# EasyEDA schematic Lego_BLE_controller_schematic_v1.json
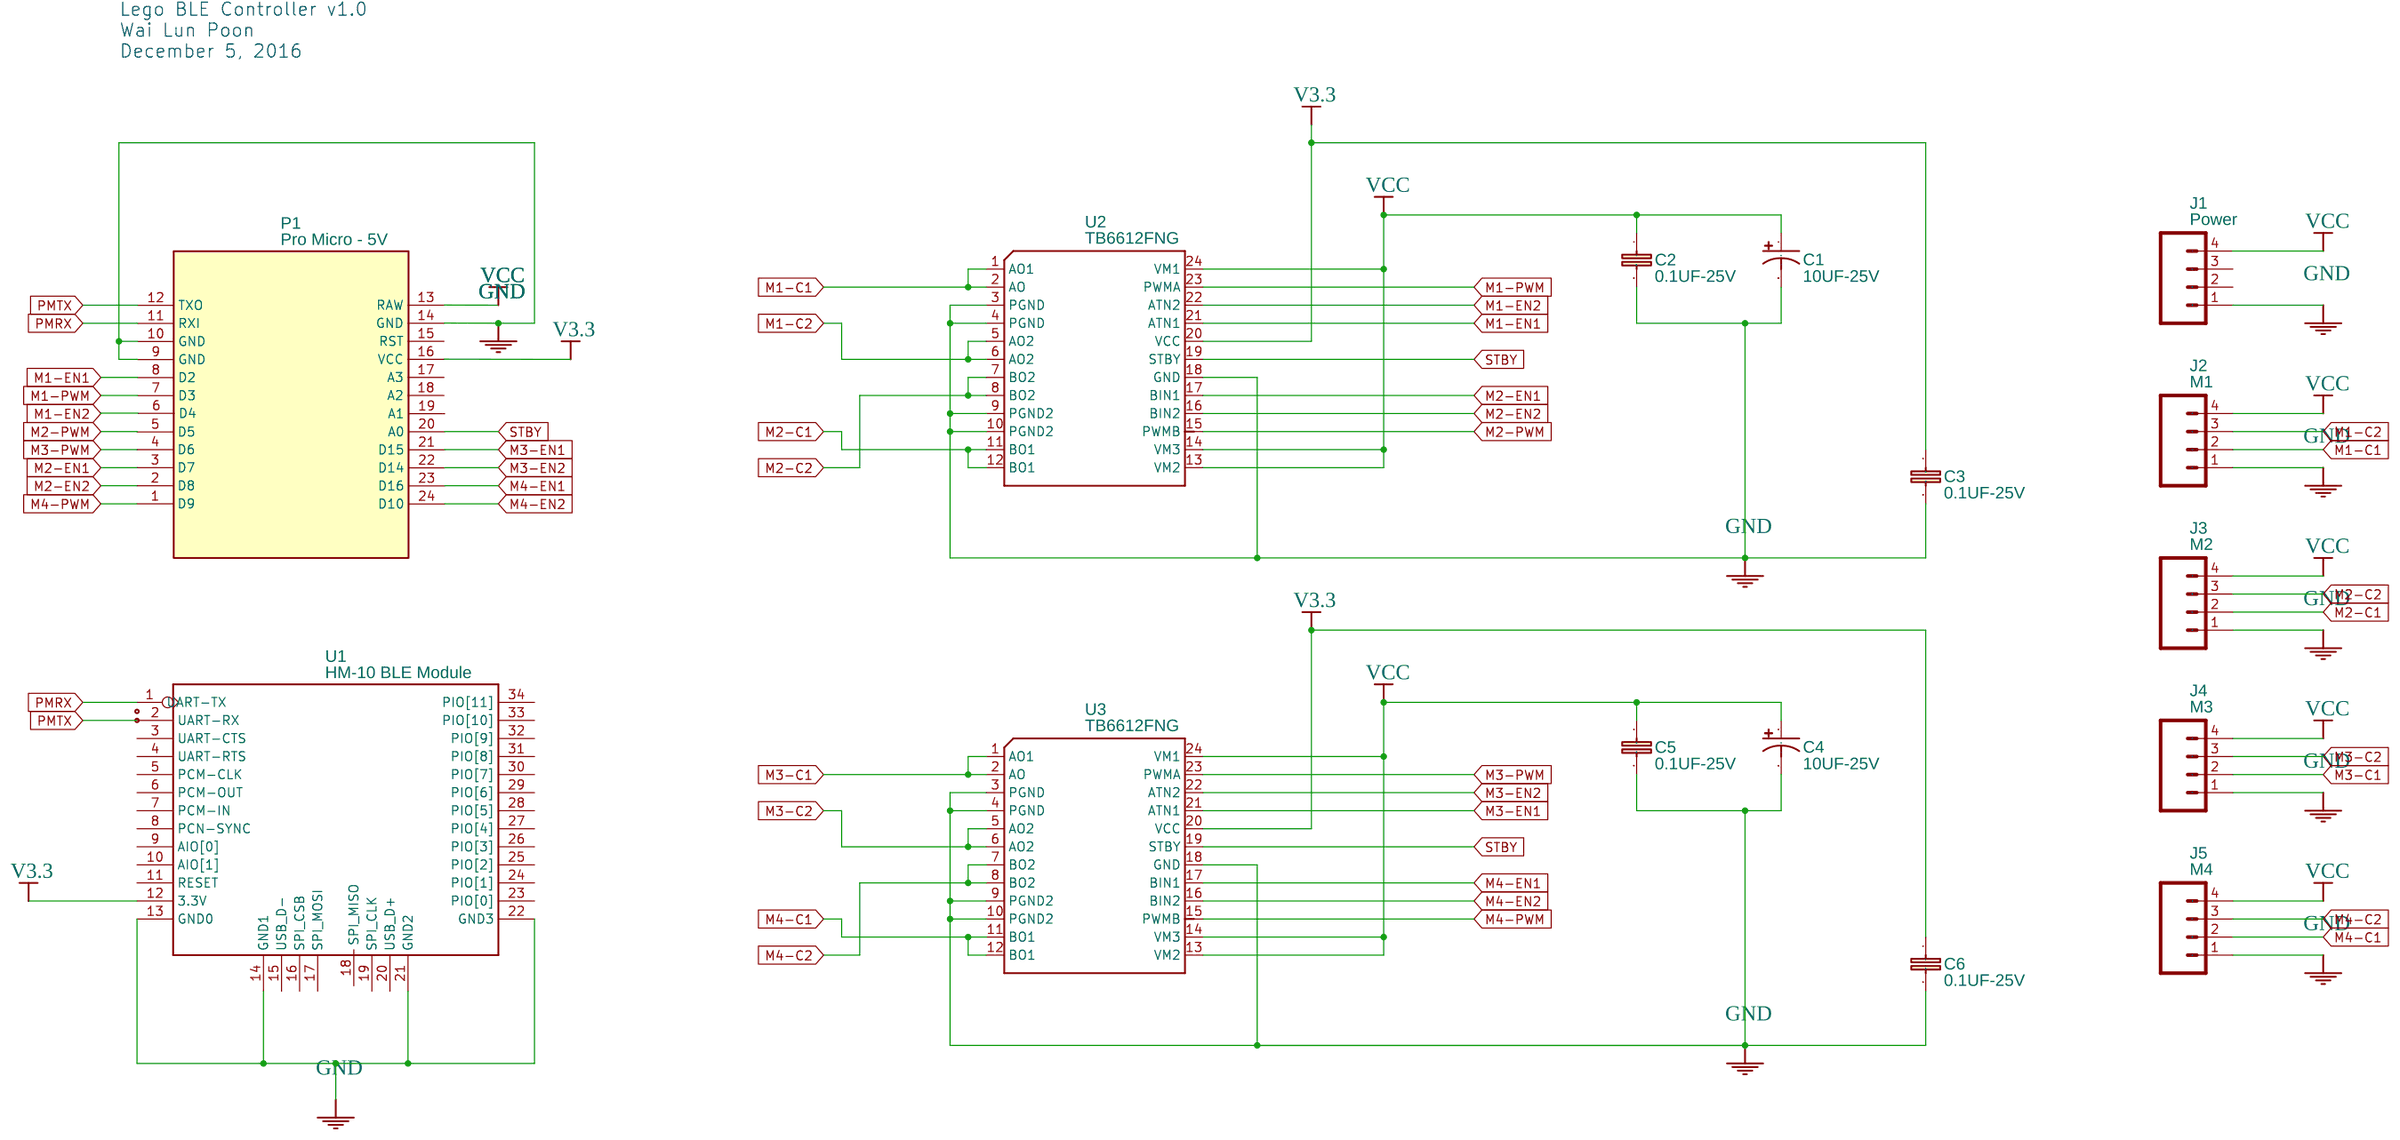
[diagram p0: schematic sheet]

## Parts
C1  10UF-25V  [EIA6032-NOM]
C2  0.1UF-25V  [0603-CAP]
C3  0.1UF-25V  [0603-CAP]
C4  10UF-25V  [EIA6032-NOM]
C5  0.1UF-25V  [0603-CAP]
C6  0.1UF-25V  [0603-CAP]
J1  Power  [JST-XH 4]
J2  M1  [JST-XH 4]
J3  M2  [JST-XH 4]
J4  M3  [JST-XH 4]
J5  M4  [JST-XH 4]
P1  Pro Micro - 5V  [Pro Micro - 5V]
U1  HM-10 BLE Module  [BT34P-SMD-1.5-26.9X13.0X2.2MM]
U2  TB6612FNG  [SSOP24-0.65-8.9X5.3MM]
U3  TB6612FNG  [SSOP24-0.65-8.9X5.3MM]

## Library data of the parts
C1 C4 = -: http:www.digikey.comproduct-detailenT491C106K025AT7280399-10159-2-ND3759638; catid: 20; Contributor: SparkFun; Manufacturer Part: ?
C2 C3 C5 C6 = -: CAP-00810; catid: 20; Contributor: SparkFun; Manufacturer Part: ?
J1-J5 = -: Header 4; catid: 20; Manufacturer Part: ?
P1 = -: catid: 20; sourceId: 1T5FDZYC8; Manufacturer Part: ?
U1 = -: SMD BT module; Bluetooth V2.0 Serial Transceiver Module - 3.3V; catid: 20; Supplier: SeeedStudio; SeeedStudio: 317030002; Manufacturer Part: HC-05; sourceId: xXR8qI0UA
U2 U3 = -: SMD IC MotorDriver;Dual -15V- 1.2A; catid: 20; sourceId: 9WQ8qkCUc; Supplier: SeeedStudio; SeeedStudio: 310040007; Manufacturer Part: TB6612FNG(O-C8-EL)

## Nets
GND: C1.C(-) C2.2 C3.2 C4.C(-) C5.2 C6.2 J1.1 J2.1 J3.1 J4.1 J5.1 P1.9(GND) P1.10(GND) P1.14(GND) U1.13(GND0) U1.14(GND1) U1.21(GND2) U1.22(GND3) U2.3(PGND) U2.4(PGND) U2.9(PGND2) U2.10(PGND2) U2.18(GND) U3.3(PGND) U3.4(PGND) U3.9(PGND2) U3.10(PGND2) U3.18(GND)
V3.3: C3.1 C6.1 P1.16(VCC) U1.12(3.3V) U2.20(VCC) U3.20(VCC)
VCC: C1.A(+) C2.1 C4.A(+) C5.1 J1.4 J2.4 J3.4 J4.4 J5.4 P1.13(RAW) U2.13(VM2) U2.14(VM3) U2.24(VM1) U3.13(VM2) U3.14(VM3) U3.24(VM1)
M1-C1: J2.2 U2.1(AO1) U2.2(AO)
M1-C2: J2.3 U2.5(AO2) U2.6(AO2)
M1-EN1: P1.8(D2) U2.21(ATN1)
M1-EN2: P1.6(D4) U2.22(ATN2)
M1-PWM: P1.7(D3) U2.23(PWMA)
M2-C1: J3.2 U2.11(BO1) U2.12(BO1)
M2-C2: J3.3 U2.7(BO2) U2.8(BO2)
M2-EN1: P1.3(D7) U2.17(BIN1)
M2-EN2: P1.2(D8) U2.16(BIN2)
M2-PWM: P1.5(D5) U2.15(PWMB)
M3-C1: J4.2 U3.1(AO1) U3.2(AO)
M3-C2: J4.3 U3.5(AO2) U3.6(AO2)
M3-EN1: P1.21(D15) U3.21(ATN1)
M3-EN2: P1.22(D14) U3.22(ATN2)
M3-PWM: P1.4(D6) U3.23(PWMA)
M4-C1: J5.2 U3.11(BO1) U3.12(BO1)
M4-C2: J5.3 U3.7(BO2) U3.8(BO2)
M4-EN1: P1.23(D16) U3.17(BIN1)
M4-EN2: P1.24(D10) U3.16(BIN2)
M4-PWM: P1.1(D9) U3.15(PWMB)
PMRX: P1.11(RXI) U1.1(UART-TX)
PMTX: P1.12(TXO) U1.2(UART-RX)
STBY: P1.20(A0) U2.19(STBY) U3.19(STBY)

Not connected (* = marked no-connect by the designer): J1 2 3; P1 15(RST) 17(A3) 18(A2) 19(A1); U1 3(UART-CTS) 4(UART-RTS) 5(PCM-CLK) 6(PCM-OUT) 7(PCM-IN) 8(PCN-SYNC) 9(AIO[0]) 10(AIO[1]) 11(RESET) 15(USB_D-) 16(SPI_CSB) 17(SPI_MOSI) 18(SPI_MISO) 19(SPI_CLK) 20(USB_D+) 23(PIO[0]) 24(PIO[1]) 25(PIO[2]) 26(PIO[3]) 27(PIO[4]) 28(PIO[5]) 29(PIO[6]) 30(PIO[7]) 31(PIO[8]) 32(PIO[9]) 33(PIO[10]) 34(PIO[11])

## Notes on the sheet
- Lego BLE Controller v1.0
  Wai Lun Poon
  December 5, 2016
